# EasyEDA Pro project PCB_1_1 (1).eprj

# Board PCB_PCB_NEW_PCB_2023-03-04_2023-05-30
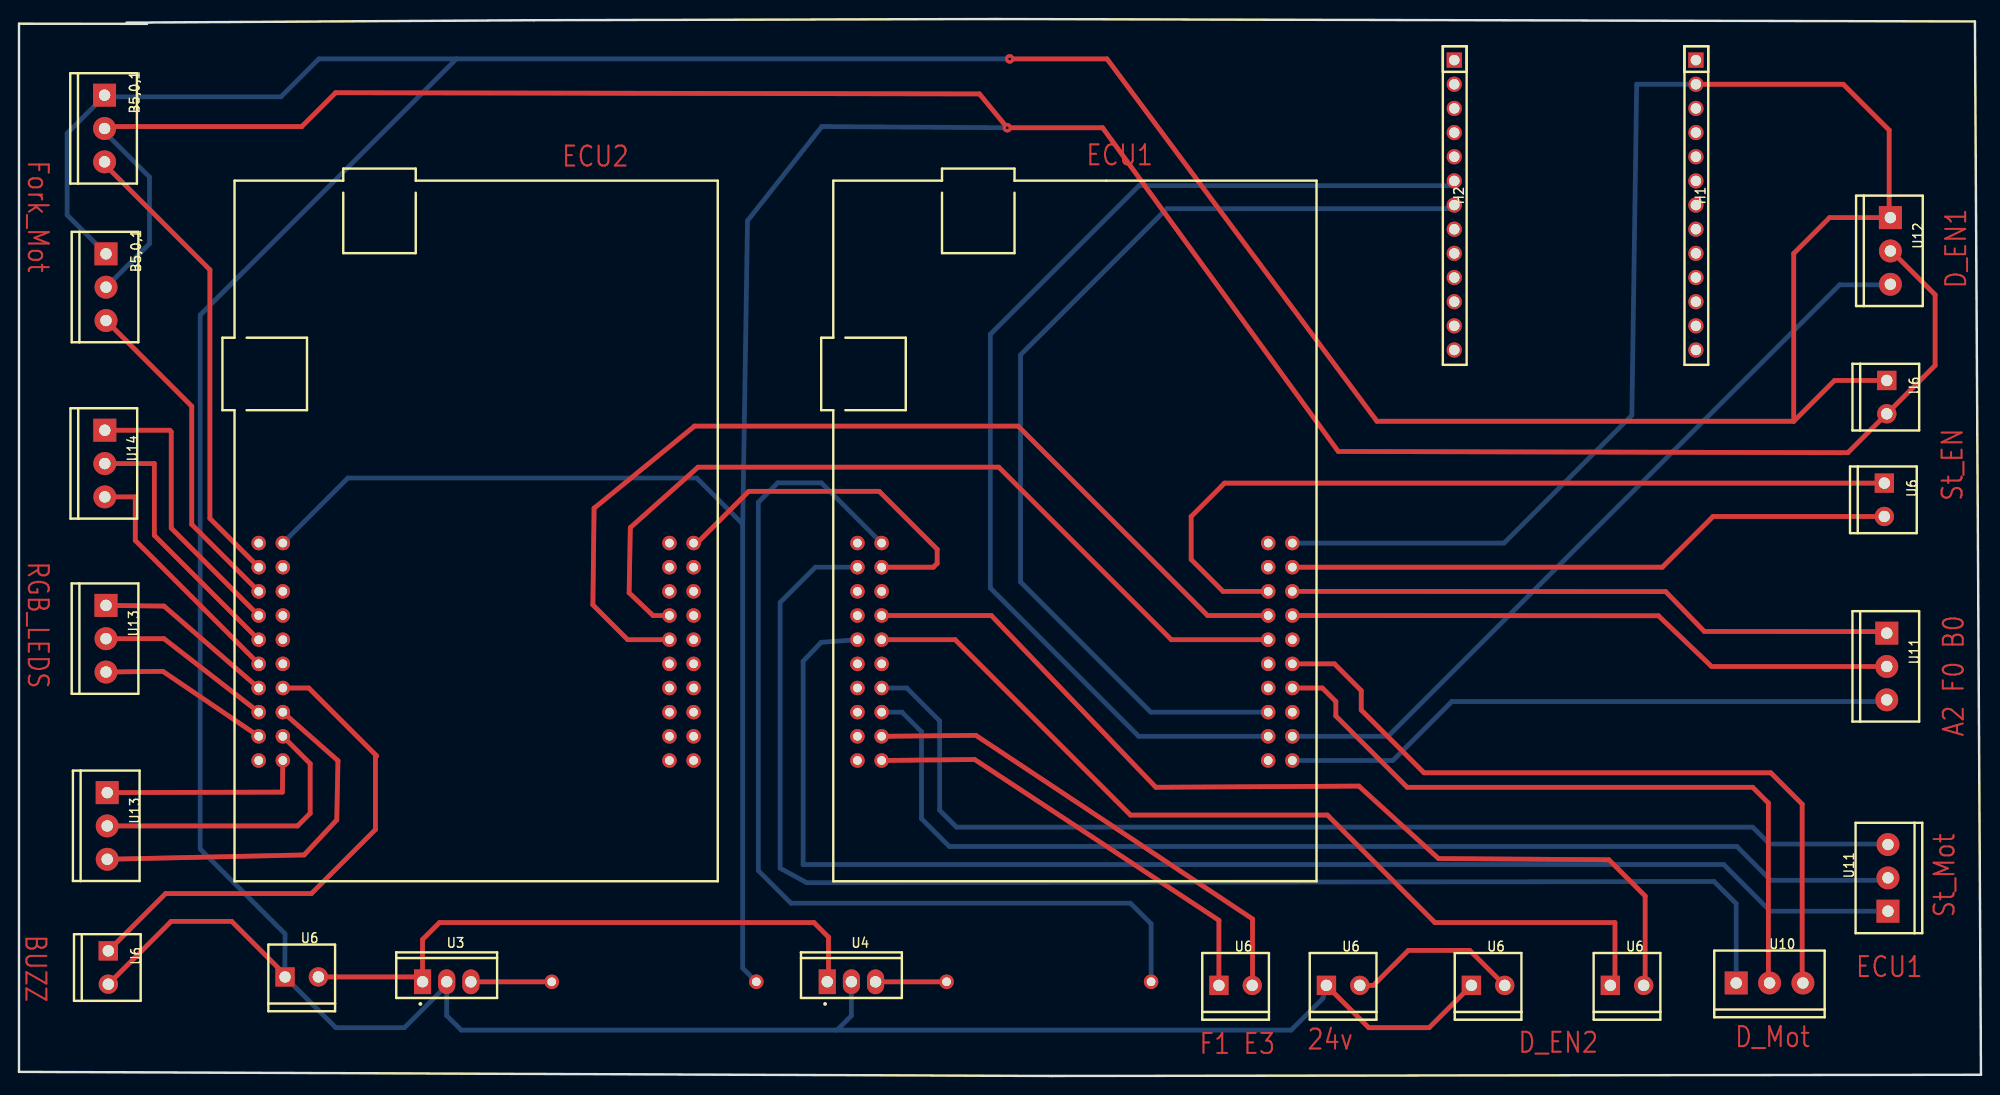
[diagram p0: board, top side]
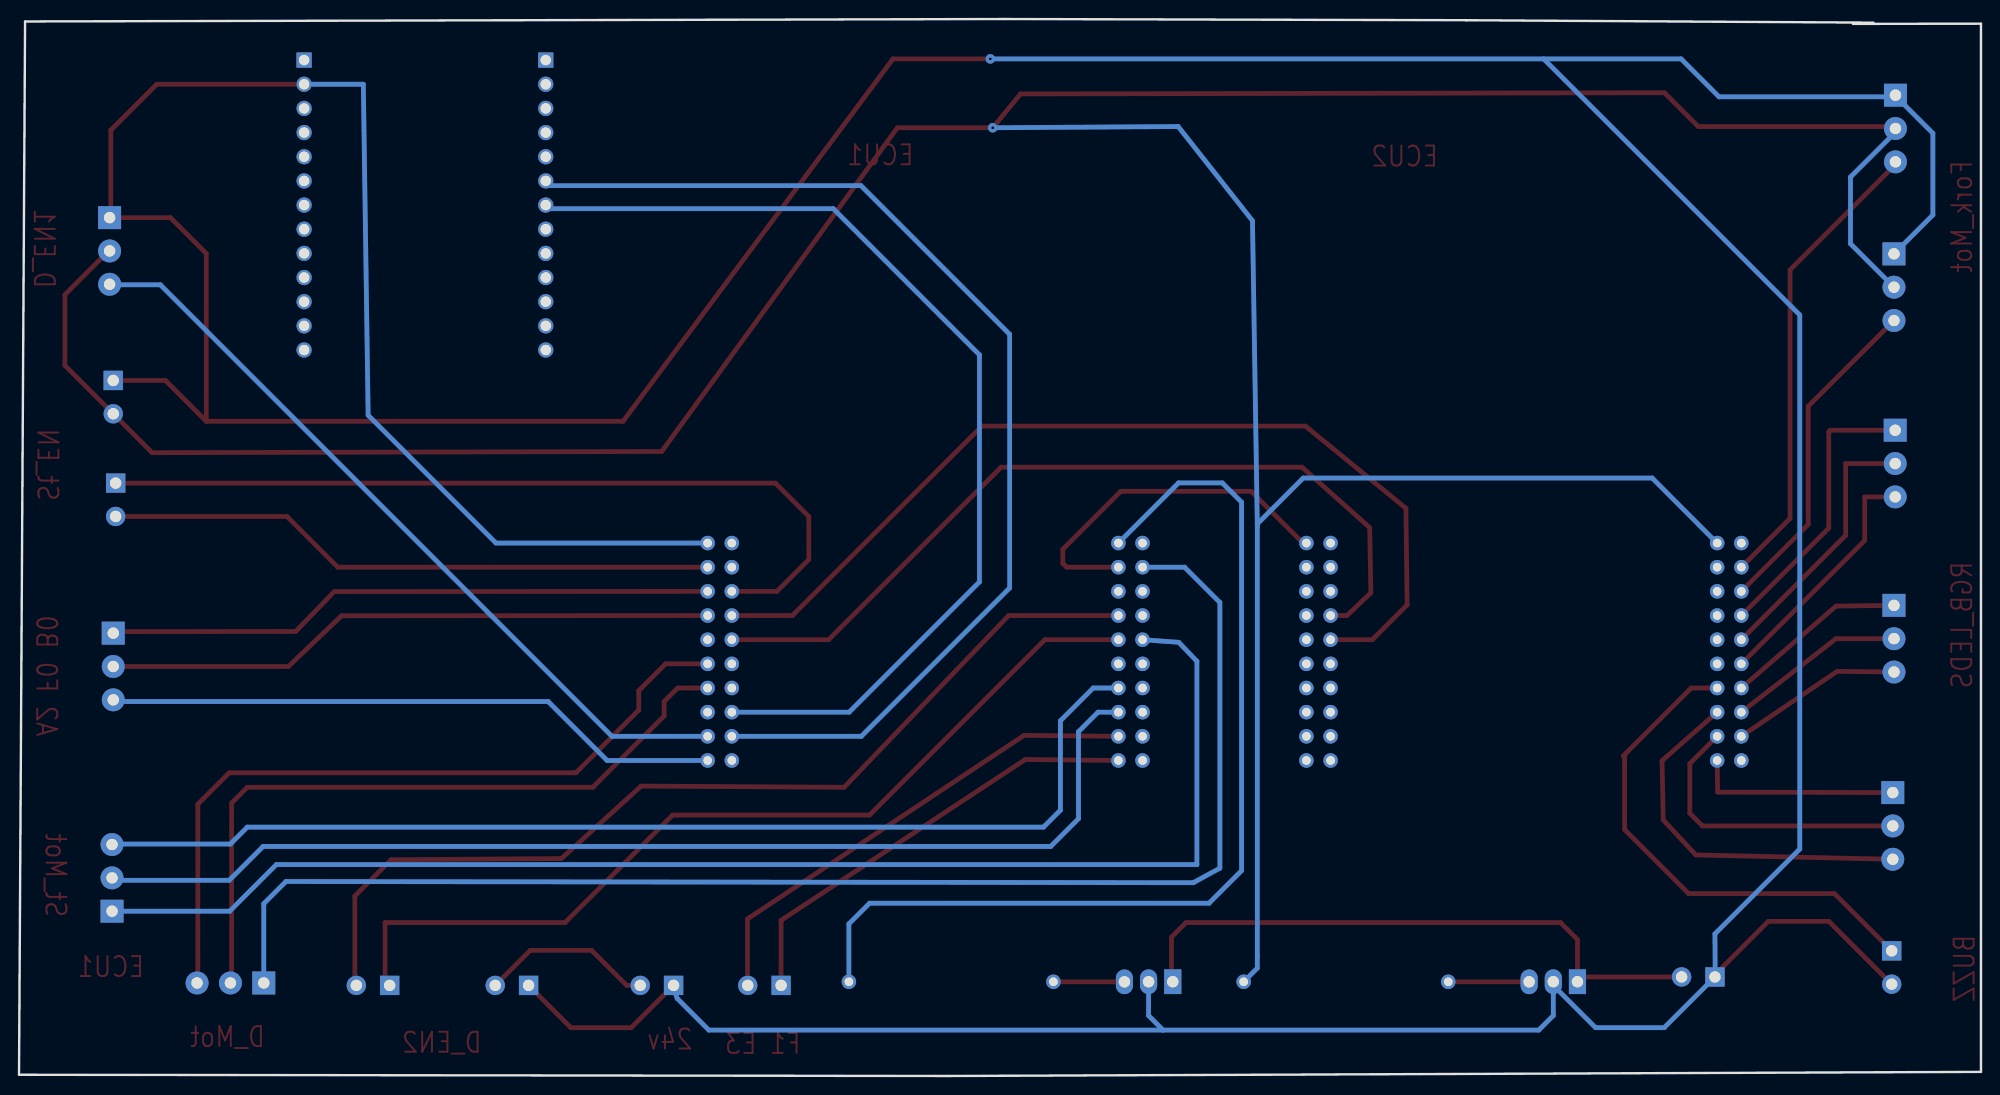
[diagram p1: board, bottom side, seen from below]

Outline 206.25 x 111.12 mm; copper layers: Top Layer, Bottom Layer. Coordinates in mm from the lower left corner of the outline.
Outline path: 13.46,110.62 0,110.63 0,0.43 108.58,0 206.25,0.13 205.61,110.87 102.62,111.12 54.1,111 11.3,110.74
Stack: Top Layer 0.035mm / Dielectric1 1.51mm FR4 er 4.5 / Bottom Layer 0.035mm

## Design rules (mm)
spacing Default (default): track to track 0.152, other pairs 0 to 0.152
track width Default (default): min 0.254, default 0.254, max 25.4
differential pair differentialPair (default): width min 0.127, default 0.254, max 2.54; gap min 0.152, default 0.152
via Default (default): diameter min 0.61, default 0.61, max 100.025; hole min 0.305, default 0.305, max 59.995

## Placement (name value [footprint] x y rotation side)
B5,0,1  -  [SCREWTERMINAL-3.5MM-3]  9.14 82.93 270 top
B5,0,1#2  -  [SCREWTERMINAL-3.5MM-3]  8.99 99.61 270 top
H1  -  [HDR-TH_13P-P2.54-V-F]  176.28 91.57 270 top
H2  -  [HDR-TH_13P-P2.54-V-F]  150.88 91.57 270 top
NOREF  -  [Pad_e344]  133.86 56.03 0 top
NOREF#2  -  [Pad_e371]  25.19 40.79 0 top
NOREF#3  -  [Pad_e398]  68.37 48.41 0 top
NOREF#4  -  [Pad_e399]  68.37 45.87 0 top
NOREF#5  -  [Pad_e336]  133.86 35.71 0 top
NOREF#6  -  [Pad_e404]  68.37 33.17 0 top
NOREF#7  -  [Pad_e381]  27.73 40.79 0 top
NOREF#8  -  [Pad_e348]  90.68 40.79 0 top
NOREF#9  -  [Pad_e369]  25.19 45.87 0 top
NOREF#10  -  [Pad_e379]  27.73 45.87 0 top
NOREF#11  -  [Pad_e397]  68.37 50.95 0 top
NOREF#12  -  [Pad_e388]  70.91 48.41 0 top
NOREF#13  -  [Pad_e373]  25.19 35.71 0 top
NOREF#14  -  [Pad_e374]  25.19 33.17 0 top
NOREF#15  -  [Pad_e356]  88.14 35.71 0 top
NOREF#16  -  [Pad_e342]  133.86 50.95 0 top
NOREF#17  -  [Pad_e402]  68.37 38.25 0 top
NOREF#18  -  [Pad_e385]  70.91 56.03 0 top
NOREF#19  -  [Pad_e393]  70.91 35.71 0 top
NOREF#20  -  [Pad_e380]  27.73 43.33 0 top
NOREF#21  -  [Pad_e330]  131.32 45.87 0 top
NOREF#22  -  [Pad_e343]  133.86 53.49 0 top
NOREF#23  -  [Pad_e289]  97.51 9.91 0 top
NOREF#24  -  [Pad_e376]  27.73 53.49 0 top
NOREF#25  -  [Pad_e390]  70.91 43.33 0 top
NOREF#26  -  [Pad_e372]  25.19 38.25 0 top
NOREF#27  -  [Pad_e367]  25.19 50.95 0 top
NOREF#28  -  [Pad_e328]  131.32 40.79 0 top
NOREF#29  -  [Pad_e403]  68.37 35.71 0 top
NOREF#30  -  [Pad_e360]  88.14 45.87 0 top
NOREF#31  -  [Pad_e332]  131.32 50.95 0 top
NOREF#32  -  [Pad_e331]  131.32 48.41 0 top
NOREF#33  -  [Pad_e333]  131.32 53.49 0 top
NOREF#34  -  [Pad_e351]  90.68 48.41 0 top
NOREF#35  -  [Pad_e368]  25.19 48.41 0 top
NOREF#36  -  [Pad_e375]  27.73 56.03 0 top
NOREF#37  -  [Pad_e339]  133.86 43.33 0 top
NOREF#38  -  [Pad_e345]  90.68 33.17 0 top
NOREF#39  -  [Pad_e365]  25.19 56.03 0 top
NOREF#40  -  [Pad_e350]  90.68 45.87 0 top
NOREF#41  -  [Pad_e400]  68.37 43.33 0 top
NOREF#42  -  [Pad_e386]  70.91 53.49 0 top
NOREF#43  -  [Pad_e340]  133.86 45.87 0 top
NOREF#44  -  [Pad_e366]  25.19 53.49 0 top
NOREF#45  -  [Pad_e359]  88.14 43.33 0 top
NOREF#46  -  [Pad_e362]  88.14 50.95 0 top
NOREF#47  -  [Pad_e334]  131.32 56.03 0 top
NOREF#48  -  [Pad_e378]  27.73 48.41 0 top
NOREF#49  -  [Pad_e337]  133.86 38.25 0 top
NOREF#50  -  [Pad_e290]  119.01 9.91 0 top
NOREF#51  -  [Pad_e387]  70.91 50.95 0 top
NOREF#52  -  [Pad_e361]  88.14 48.41 0 top
NOREF#53  -  [Pad_e355]  88.14 33.17 0 top
NOREF#54  -  [Pad_e329]  131.32 43.33 0 top
NOREF#55  -  [Pad_e354]  90.68 56.03 0 top
NOREF#56  -  [Pad_e389]  70.91 45.87 0 top
NOREF#57  -  [Pad_e370]  25.19 43.33 0 top
NOREF#58  -  [Pad_e392]  70.91 38.25 0 top
NOREF#59  -  [Pad_e395]  68.37 56.03 0 top
NOREF#60  -  [Pad_e383]  27.73 35.71 0 top
NOREF#61  -  [Pad_e326]  131.32 35.71 0 top
NOREF#62  -  [Pad_e325]  131.32 33.17 0 top
NOREF#63  -  [Pad_e377]  27.73 50.95 0 top
NOREF#64  -  [Pad_e327]  131.32 38.25 0 top
NOREF#65  -  [Pad_e363]  88.14 53.49 0 top
NOREF#66  -  [Pad_e391]  70.91 40.79 0 top
NOREF#67  -  [Pad_e382]  27.73 38.25 0 top
NOREF#68  -  [Pad_e349]  90.68 43.33 0 top
NOREF#69  -  [Pad_e347]  90.68 38.25 0 top
NOREF#70  -  [Pad_e338]  133.86 40.79 0 top
NOREF#71  -  [Pad_e267]  56 9.9 0 top
NOREF#72  -  [Pad_e358]  88.14 40.79 0 top
NOREF#73  -  [Pad_e352]  90.68 50.95 0 top
NOREF#74  -  [Pad_e341]  133.86 48.41 0 top
NOREF#75  -  [Pad_e272]  77.51 9.91 0 top
NOREF#76  -  [Pad_e346]  90.68 35.71 0 top
NOREF#77  -  [Pad_e353]  90.68 53.49 0 top
NOREF#78  -  [Pad_e394]  70.91 33.17 0 top
NOREF#79  -  [Pad_e335]  133.86 33.17 0 top
NOREF#80  -  [Pad_e364]  88.14 56.03 0 top
NOREF#81  -  [Pad_e401]  68.37 40.79 0 top
NOREF#82  -  [Pad_e384]  27.73 33.17 0 top
NOREF#83  -  [Pad_e396]  68.37 53.49 0 top
NOREF#84  -  [Pad_e357]  88.14 38.25 0 top
U3  -  [TO-220-3_L10.0-W4.5-P2.54-L]  44.96 9.91 0 top
U4  -  [TO-220-3_L10.0-W4.5-P2.54-L]  87.5 9.91 0 top
U6  -  [SCREWTERMINAL-3.5MM-2]  127.89 9.52 0 top
U6#2  -  [SCREWTERMINAL-3.5MM-2]  29.72 10.41 0 top
U6#3  -  [SCREWTERMINAL-3.5MM-2]  196.09 60.58 270 top
U6#4  -  [SCREWTERMINAL-3.5MM-2]  196.34 71.37 270 top
U6#5  -  [SCREWTERMINAL-3.5MM-2]  169.04 9.52 0 top
U6#6  -  [SCREWTERMINAL-3.5MM-2]  139.19 9.52 0 top
U6#7  -  [SCREWTERMINAL-3.5MM-2]  154.43 9.52 0 top
U6#8  -  [SCREWTERMINAL-3.5MM-2]  9.39 11.4 270 top
U10  -  [SCREWTERMINAL-3.5MM-3]  184.02 9.78 0 top
U11  -  [SCREWTERMINAL-3.5MM-3]  196.47 20.83 90 top
U11#2  -  [SCREWTERMINAL-3.5MM-3]  196.34 43.05 270 top
U12  -  [SCREWTERMINAL-3.5MM-3]  196.72 86.74 270 top
U13  -  [SCREWTERMINAL-3.5MM-3]  9.14 45.97 270 top
U13#2  -  [SCREWTERMINAL-3.5MM-3]  9.27 26.29 270 top
U14  -  [SCREWTERMINAL-3.5MM-3]  9.02 64.39 270 top

## Footprints (pads in the part's own frame, mm; a bottom-side part is the same pattern mirrored in y, then rotated)
HDR-TH_13P-P2.54-V-F
  rect 1.6x1.6 hole 1.1: 1(-15.24,0)
  round 1.6 hole 1.1: 2(-12.7,0) 3(-10.16,0) 4(-7.62,0) 5(-5.08,0) 6(-2.54,0) 7(0,0) 8(2.54,0) 9(5.08,0) 10(7.62,0) 11(10.16,0) 12(12.7,0) 13(15.24,0)
Pad_e267
  round 1.524 hole 0.914: 1(0,0)
Pad_e272
  round 1.524 hole 0.914: 2(0,0)
Pad_e289
  round 1.524 hole 0.914: 1(0,0)
Pad_e290
  round 1.524 hole 0.914: 2(0,0)
Pad_e325
  round 1.524 hole 0.914: 40(0,0)
Pad_e326
  round 1.524 hole 0.914: 39(0,0)
Pad_e327
  round 1.524 hole 0.914: 38(0,0)
Pad_e328
  round 1.524 hole 0.914: 37(0,0)
Pad_e329
  round 1.524 hole 0.914: 36(0,0)
Pad_e330
  round 1.524 hole 0.914: 35(0,0)
Pad_e331
  round 1.524 hole 0.914: 34(0,0)
Pad_e332
  round 1.524 hole 0.914: 33(0,0)
Pad_e333
  round 1.524 hole 0.914: 32(0,0)
Pad_e334
  round 1.524 hole 0.914: 31(0,0)
Pad_e335
  round 1.524 hole 0.914: 30(0,0)
Pad_e336
  round 1.524 hole 0.914: 29(0,0)
Pad_e337
  round 1.524 hole 0.914: 28(0,0)
Pad_e338
  round 1.524 hole 0.914: 27(0,0)
Pad_e339
  round 1.524 hole 0.914: 26(0,0)
Pad_e340
  round 1.524 hole 0.914: 25(0,0)
Pad_e341
  round 1.524 hole 0.914: 24(0,0)
Pad_e342
  round 1.524 hole 0.914: 23(0,0)
Pad_e343
  round 1.524 hole 0.914: 22(0,0)
Pad_e344
  round 1.524 hole 0.914: 21(0,0)
Pad_e345
  round 1.524 hole 0.914: 20(0,0)
Pad_e346
  round 1.524 hole 0.914: 19(0,0)
Pad_e347
  round 1.524 hole 0.914: 18(0,0)
Pad_e348
  round 1.524 hole 0.914: 17(0,0)
Pad_e349
  round 1.524 hole 0.914: 16(0,0)
Pad_e350
  round 1.524 hole 0.914: 15(0,0)
Pad_e351
  round 1.524 hole 0.914: 14(0,0)
Pad_e352
  round 1.524 hole 0.914: 13(0,0)
Pad_e353
  round 1.524 hole 0.914: 12(0,0)
Pad_e354
  round 1.524 hole 0.914: 11(0,0)
Pad_e355
  round 1.524 hole 0.914: 10(0,0)
Pad_e356
  round 1.524 hole 0.914: 9(0,0)
Pad_e357
  round 1.524 hole 0.914: 8(0,0)
Pad_e358
  round 1.524 hole 0.914: 7(0,0)
Pad_e359
  round 1.524 hole 0.914: 6(0,0)
Pad_e360
  round 1.524 hole 0.914: 5(0,0)
Pad_e361
  round 1.524 hole 0.914: 4(0,0)
Pad_e362
  round 1.524 hole 0.914: 3(0,0)
Pad_e363
  round 1.524 hole 0.914: 2(0,0)
Pad_e364
  round 1.524 hole 0.914: 1(0,0)
Pad_e365
  round 1.524 hole 0.914: 1(0,0)
Pad_e366
  round 1.524 hole 0.914: 2(0,0)
Pad_e367
  round 1.524 hole 0.914: 3(0,0)
Pad_e368
  round 1.524 hole 0.914: 4(0,0)
Pad_e369
  round 1.524 hole 0.914: 5(0,0)
Pad_e370
  round 1.524 hole 0.914: 6(0,0)
Pad_e371
  round 1.524 hole 0.914: 7(0,0)
Pad_e372
  round 1.524 hole 0.914: 8(0,0)
Pad_e373
  round 1.524 hole 0.914: 9(0,0)
Pad_e374
  round 1.524 hole 0.914: 10(0,0)
Pad_e375
  round 1.524 hole 0.914: 11(0,0)
Pad_e376
  round 1.524 hole 0.914: 12(0,0)
Pad_e377
  round 1.524 hole 0.914: 13(0,0)
Pad_e378
  round 1.524 hole 0.914: 14(0,0)
Pad_e379
  round 1.524 hole 0.914: 15(0,0)
Pad_e380
  round 1.524 hole 0.914: 16(0,0)
Pad_e381
  round 1.524 hole 0.914: 17(0,0)
Pad_e382
  round 1.524 hole 0.914: 18(0,0)
Pad_e383
  round 1.524 hole 0.914: 19(0,0)
Pad_e384
  round 1.524 hole 0.914: 20(0,0)
Pad_e385
  round 1.524 hole 0.914: 21(0,0)
Pad_e386
  round 1.524 hole 0.914: 22(0,0)
Pad_e387
  round 1.524 hole 0.914: 23(0,0)
Pad_e388
  round 1.524 hole 0.914: 24(0,0)
Pad_e389
  round 1.524 hole 0.914: 25(0,0)
Pad_e390
  round 1.524 hole 0.914: 26(0,0)
Pad_e391
  round 1.524 hole 0.914: 27(0,0)
Pad_e392
  round 1.524 hole 0.914: 28(0,0)
Pad_e393
  round 1.524 hole 0.914: 29(0,0)
Pad_e394
  round 1.524 hole 0.914: 30(0,0)
Pad_e395
  round 1.524 hole 0.914: 31(0,0)
Pad_e396
  round 1.524 hole 0.914: 32(0,0)
Pad_e397
  round 1.524 hole 0.914: 33(0,0)
Pad_e398
  round 1.524 hole 0.914: 34(0,0)
Pad_e399
  round 1.524 hole 0.914: 35(0,0)
Pad_e400
  round 1.524 hole 0.914: 36(0,0)
Pad_e401
  round 1.524 hole 0.914: 37(0,0)
Pad_e402
  round 1.524 hole 0.914: 38(0,0)
Pad_e403
  round 1.524 hole 0.914: 39(0,0)
Pad_e404
  round 1.524 hole 0.914: 40(0,0)
SCREWTERMINAL-3.5MM-2
  rect 2.032x2.032 hole 1.199: 1(-1.752,0)
  round 2.032 hole 1.199: 2(1.752,0)
SCREWTERMINAL-3.5MM-3
  rect 2.413x2.413 hole 1.199: 1(-3.505,0)
  round 2.413 hole 1.199: 2(0,0) 3(3.505,0)
TO-220-3_L10.0-W4.5-P2.54-L
  rect 1.8x2.6 hole 1.2: 1(-2.54,0.005)
  oval 1.8x2.6 hole 1.2: 2(0,0.005) 3(2.541,-0.005)

## Nets
S$7338: H1.1 NOREF#55.11 U4.3
S$20579: NOREF#3.34 NOREF#6.40 NOREF#21.35
S$20620: B5,0,1.1 B5,0,1.2 B5,0,1.3 B5,0,1#2.1 B5,0,1#2.2 B5,0,1#2.3 H1.2 H2.2 NOREF.21 NOREF#2.7 NOREF#5.29 NOREF#7.17 NOREF#8.17 NOREF#9.5 NOREF#10.15 NOREF#11.33 NOREF#12.24 NOREF#13.9 NOREF#14.10 NOREF#16.23 NOREF#17.38 NOREF#18.21 NOREF#20.16 NOREF#22.22 NOREF#24.12 NOREF#26.8 NOREF#27.3 NOREF#30.5 NOREF#33.32 NOREF#35.4 NOREF#37.26 NOREF#39.1 NOREF#40.15 NOREF#44.2 NOREF#46.3 NOREF#48.14 NOREF#52.4 NOREF#57.6 NOREF#58.28 NOREF#59.31 NOREF#60.19 NOREF#63.13 NOREF#65.2 NOREF#67.18 NOREF#69.18 NOREF#70.27 NOREF#77.12 NOREF#78.30 NOREF#79.30 NOREF#80.1 NOREF#82.20 NOREF#83.32 U3.1 U3.2 U4.1 U4.2 U6.1 U6.2 U6#2.1 U6#2.2 U6#3.1 U6#3.2 U6#4.1 U6#4.2 U6#5.1 U6#5.2 U6#6.1 U6#6.2 U6#7.1 U6#7.2 U6#8.1 U6#8.2 U10.1 U10.2 U10.3 U11.1 U11.2 U11.3 U11#2.1 U11#2.2 U11#2.3 U12.1 U12.2 U12.3 U13.1 U13.2 U13.3 U13#2.1 U13#2.2 U13#2.3 U14.1 U14.2 U14.3
S$24086: NOREF#42.22
S$26821: NOREF#19.29
S$26946: NOREF#4.35 NOREF#32.34
S$81774: NOREF#29.39 NOREF#31.33 NOREF#34.14
S$86216: NOREF#36.11 U3.3
S$108136: H2.6 NOREF#61.39
S$108149: H2.7 NOREF#64.38

Pads without a net: H1 3 4 5 6 7 8 9 10 11 12 13; H2 1 3 4 5 8 9 10 11 12 13; NOREF#15 9; NOREF#23 1; NOREF#25 26; NOREF#28 37; NOREF#38 20; NOREF#41 36; NOREF#43 25; NOREF#45 6; NOREF#47 31; NOREF#49 28; NOREF#50 2; NOREF#51 23; NOREF#53 10; NOREF#54 36; NOREF#56 25; NOREF#62 40; NOREF#66 27; NOREF#68 16; NOREF#71 1; NOREF#72 7; NOREF#73 13; NOREF#74 24; NOREF#75 2; NOREF#76 19; NOREF#81 37; NOREF#84 8

## Via types
v1: diameter 1, hole 0.305, Top Layer to Bottom Layer, 2 vias

## Routing (per net, layer and track width the routed paths; a pad name or vN(x,y) marks a point on that pad's centre or on a via; arc(x,y) is an arc through that point)
S$7338: length 95.7
  Bottom Layer w0.5: 116.84,18.16 81.15,18.16 77.72,21.59 77.72,60.32 79.76,62.36 84.35,62.36 NOREF#55.11
S$20579: length 0.2
  Bottom Layer w0.5: 131.17,45.72 NOREF#21.35
S$20620: length 779.4
  Top Layer w0.5: NOREF#37.26 138.28,43.33 141.1,40.51 141.1,38.48 147.7,31.88 184.15,31.88 187.45,28.57 187.45,9.85 U10.3 ; U10.2 183.9,9.91 183.9,28.7 182.25,30.35 145.92,30.35 138.43,37.84 138.43,39.37 137.01,40.79 NOREF#70.27 ; U6#5.1 167.77,10.01 167.77,16.13 148.84,16.13 137.54,27.43 116.84,27.43 98.4,45.87 NOREF#40.15
  Bottom Layer w0.5: U10.1 180.52,18.11 178.18,20.45 82.8,20.32 80.01,21.84 80.01,49.78 83.72,53.49 NOREF#65.2 ; NOREF#8.17 93.32,40.79 96.77,37.34 96.77,27.94 98.55,26.16 182.25,26.16 184.02,24.38 196.42,24.38 196.47,24.33 ; U11.2 196.21,20.57 184.15,20.57 180.59,24.13 97.79,24.13 94.87,27.05 94.87,36.19 92.81,38.25 NOREF#69.18 ; NOREF#30.5 84.33,45.59 82.42,43.61 82.42,22.22 179.2,22.22 184.1,17.32 U11.1
  vias: v1(104.14,106.93)
S$26946: length 0.1
  Bottom Layer w0.5: 131.21,48.51 NOREF#32.34
S$86216: length 286.7
  Top Layer w0.5: 47.15,9.9 U3.3 56,9.9 56.01,9.91 ; v1(103.89,99.69) 113.91,99.69 138.68,65.66 192.25,65.53 196.34,69.62
  Bottom Layer w0.5: 76.07,57.78 76.58,89.91 84.39,99.82 104.01,99.69 v1(103.89,99.69) ; 77.51,9.91 76.07,11.34 76.07,58.04 71.25,62.86 34.57,62.86 27.73,56.03
S$108136: length 117.8
  Bottom Layer w0.5: H2.6 150.38,93.61 117.74,93.61 102.11,77.98 102.11,51.31 117.7,35.71 NOREF#61.39
S$108149: length 107.7
  Bottom Layer w0.5: NOREF#64.38 118.98,38.25 105.28,51.94 105.28,75.82 120.65,91.19 150.5,91.19 H2.7

## Text on the board
Top Layer: BUZZ | Fork_Mot | RGB_LEDS | ECU2 | ECU1 | F1 E3 | 24v | D_EN2 | D_Mot | St_Mot | St_EN | A2 F0 B0 | D_EN1
